# EAGLE design pcb paneles (EAGLE 9.6.1)
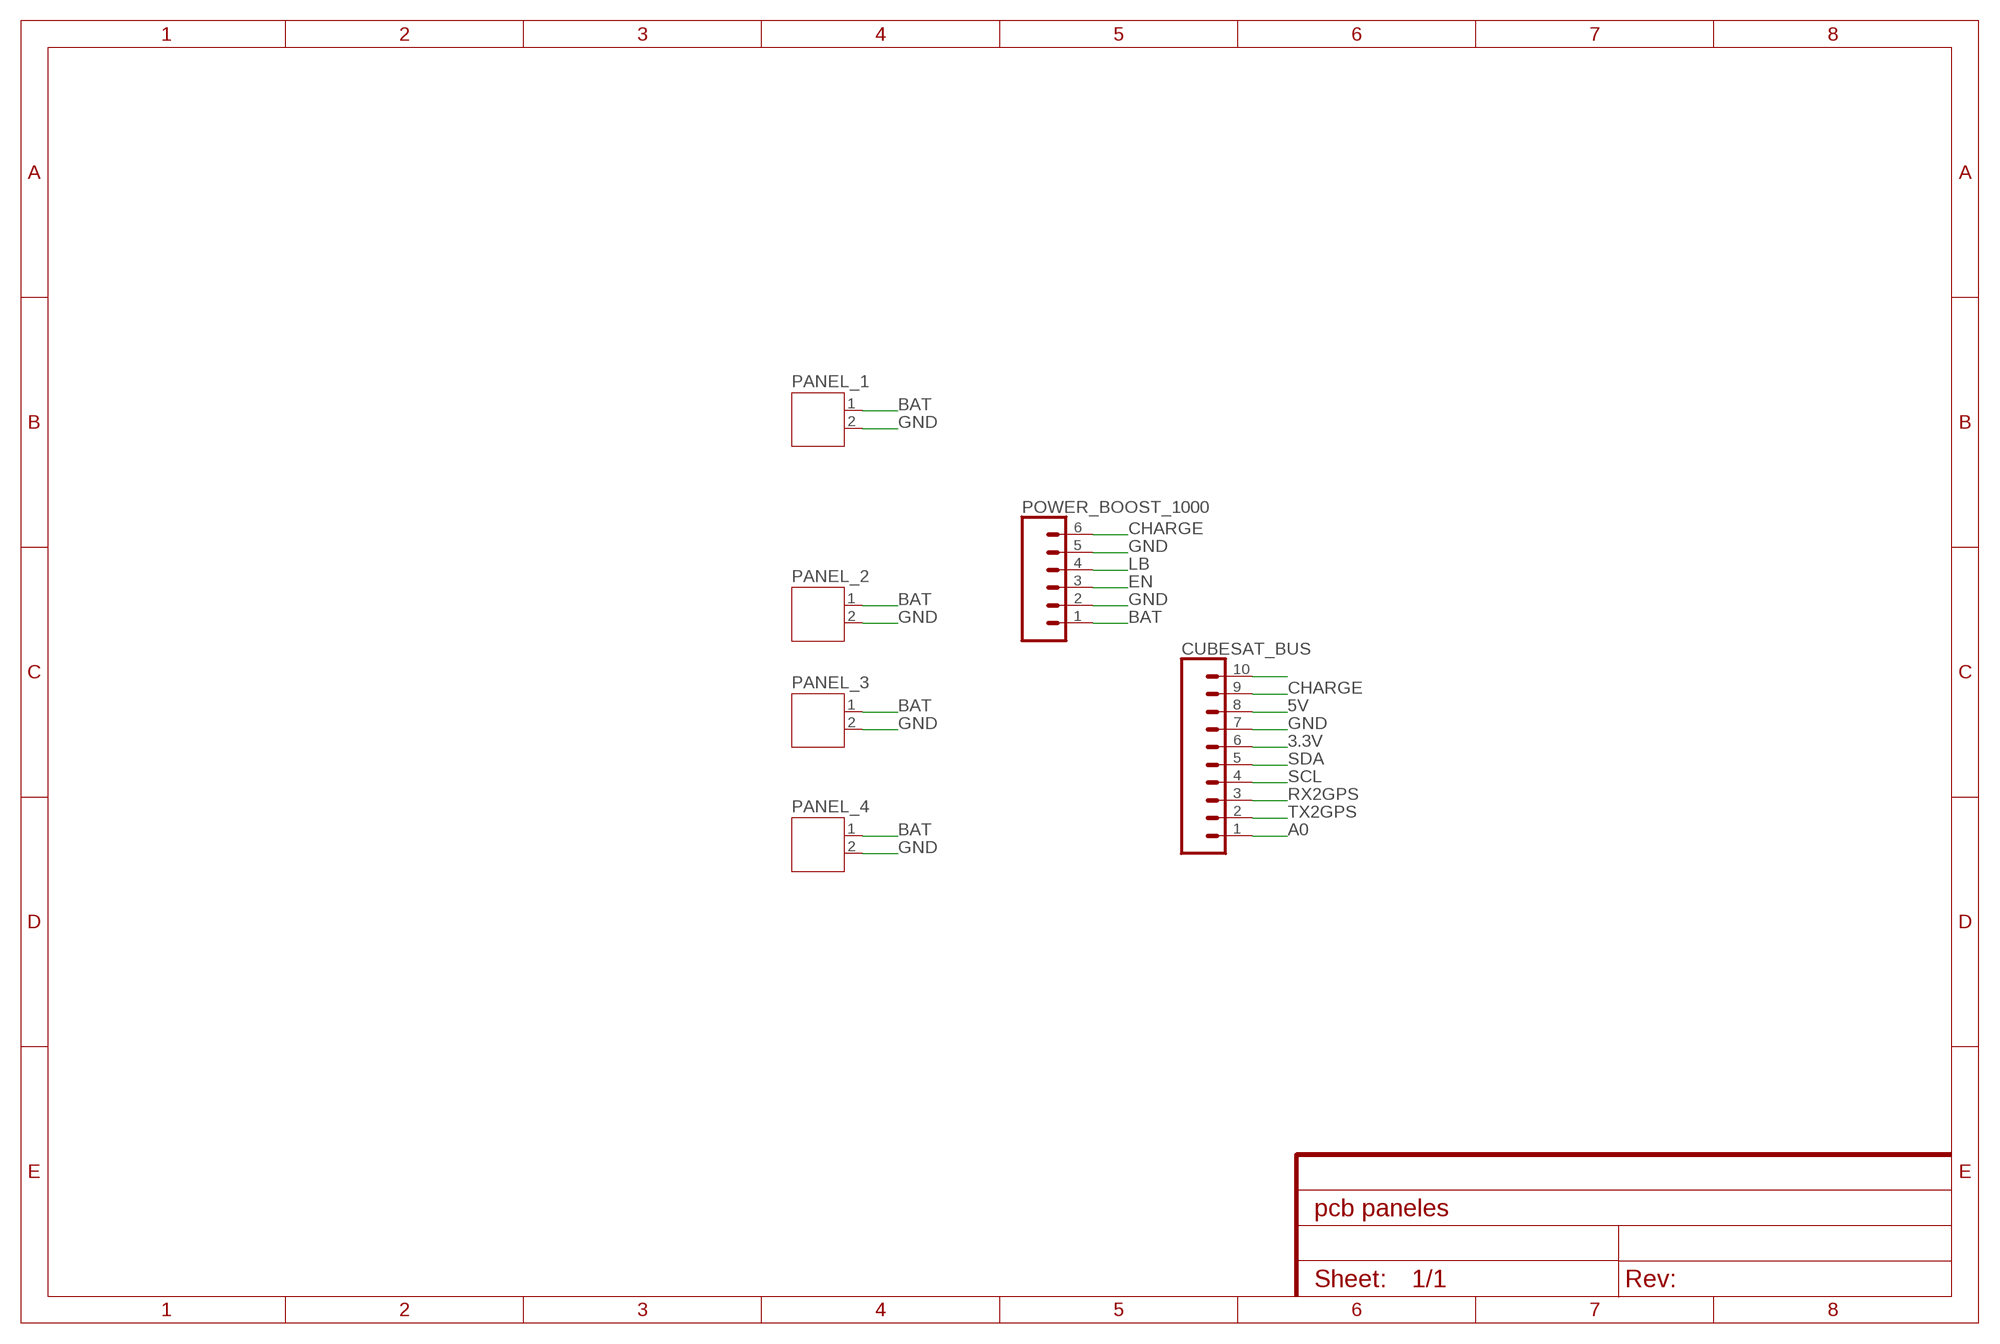
[diagram p0: schematic, sheet 1]

## Parts
CUBESAT_BUS  CONN_10"  [1X10]
PANEL_1  JST-PH2  [JST-PH2]
PANEL_2  JST-PH2  [JST-PH2]
PANEL_3  JST-PH2  [JST-PH2]
PANEL_4  JST-PH2  [JST-PH2]
POWER_BOOST_1000  CONN_06SILK_FEMALE_PTH  [1X06]

## Nets
3.3V: CUBESAT_BUS.6
5V: CUBESAT_BUS.8
A0: CUBESAT_BUS.1
BAT: PANEL_1.1 PANEL_2.1 PANEL_3.1 PANEL_4.1 POWER_BOOST_1000.1
CHARGE: CUBESAT_BUS.9 POWER_BOOST_1000.6
EN: POWER_BOOST_1000.3
GND: CUBESAT_BUS.7 PANEL_1.2 PANEL_2.2 PANEL_3.2 PANEL_4.2 POWER_BOOST_1000.2 POWER_BOOST_1000.5
LB: POWER_BOOST_1000.4
N$9: CUBESAT_BUS.10
RX2GPS: CUBESAT_BUS.3
SCL: CUBESAT_BUS.4
SDA: CUBESAT_BUS.5
TX2GPS: CUBESAT_BUS.2

## Library data of the parts
CUBESAT_BUS = SparkFun-Connectors:CONN_10: Multi connection point. Often used as Generic Header-pin footprint for 0.1 inch spaced/style header connections On any of the 0.1 inch spaced packages, you can populate with these: Break Away Headers - Straight <https://www.sparkfun.com/products/116> (PRT-00116) Break Away Male Headers - Right Angle <https://www.sparkfun.com/products/553> (PRT-00553) Female Headers <https://www.sparkfun.com/products/115> (PRT-00115) Break Away Headers - Machine Pin <https://www.sparkfun.com/products/117> (PRT-00117) Break Away Female Headers - Swiss Machine Pin <https://www.sparkfun.com/products/743> (PRT-00743) Arduino Stackable Header - 10 Pin <https://www.sparkfun.com/products/11376> (PRT-11376) For SCREWTERMINALS and SPRING TERMINALS visit here: Screw Terimnals on SparkFun.com <https://www.sparkfun.com/search/results?term=Screw+Terminals> (5mm/3.5mm/2.54mm spacing) This device is also useful as a general connection point to wire up your design to another part of your project. Our various solder wires solder well into these plated through hole pads. Hook-Up Wire - Assortment (Stranded, 22 AWG) <https://www.sparkfun.com/products/11375> (PRT-11375) Hook-Up Wire - Assortment (Solid Core, 22 AWG) <https://www.sparkfun.com/products/11367> (PRT-11367) View the entire wire category on our website here <https://www.sparkfun.com/categories/141> Special notes: Molex polarized connector foot print use with SKU : PRT-08231 with associated crimp pins and housings. 1MM SMD Version SKU: PRT-10208 NOTES ON THE VARIANTS LOCK and LOCK_LONGPADS... This footprint was designed to help hold the alignment of a through-hole component (i.e. 6-pin header) while soldering it into place. You may notice that each hole has been shifted either up or down by 0.005 of an inch from it's more standard position (which is a perfectly straight line). This slight alteration caused the pins (the squares in the middle) to touch the edges of the holes. Because they are alternating, it causes a "brace" to hold the component in place. 0.005 has proven to be the perfect amount of "off-center" position when using our standard breakaway headers. Although looks a little odd when you look at the bare footprint, once you have a header in there, the alteration is very hard to notice. Also,if you push a header all the way into place, it is covered up entirely on the bottom side.; PROD_ID: CONN-11563
PANEL_1-PANEL_4 = jst-ph:JST-PH2
POWER_BOOST_1000 = SparkFun-Connectors:CONN_06: Multi connection point. Often used as Generic Header-pin footprint for 0.1 inch spaced/style header connections On any of the 0.1 inch spaced packages, you can populate with these: Break Away Headers - Straight <https://www.sparkfun.com/products/116> (PRT-00116) Break Away Male Headers - Right Angle <https://www.sparkfun.com/products/553> (PRT-00553) Female Headers <https://www.sparkfun.com/products/115> (PRT-00115) Break Away Headers - Machine Pin <https://www.sparkfun.com/products/117> (PRT-00117) Break Away Female Headers - Swiss Machine Pin <https://www.sparkfun.com/products/743> (PRT-00743) Arduino Stackable Header - 6 Pin <https://www.sparkfun.com/products/9280> (PRT-09280) For SCREWTERMINALS and SPRING TERMINALS visit here: Screw Terimnals on SparkFun.com <https://www.sparkfun.com/search/results?term=Screw+Terminals> (5mm/3.5mm/2.54mm spacing) This device is also useful as a general connection point to wire up your design to another part of your project. Our various solder wires solder well into these plated through hole pads. Hook-Up Wire - Assortment (Stranded, 22 AWG) <https://www.sparkfun.com/products/11375> (PRT-11375) Hook-Up Wire - Assortment (Solid Core, 22 AWG) <https://www.sparkfun.com/products/11367> (PRT-11367) View the entire wire category on our website here <https://www.sparkfun.com/categories/141>; PROD_ID: CONN-08437

## Board
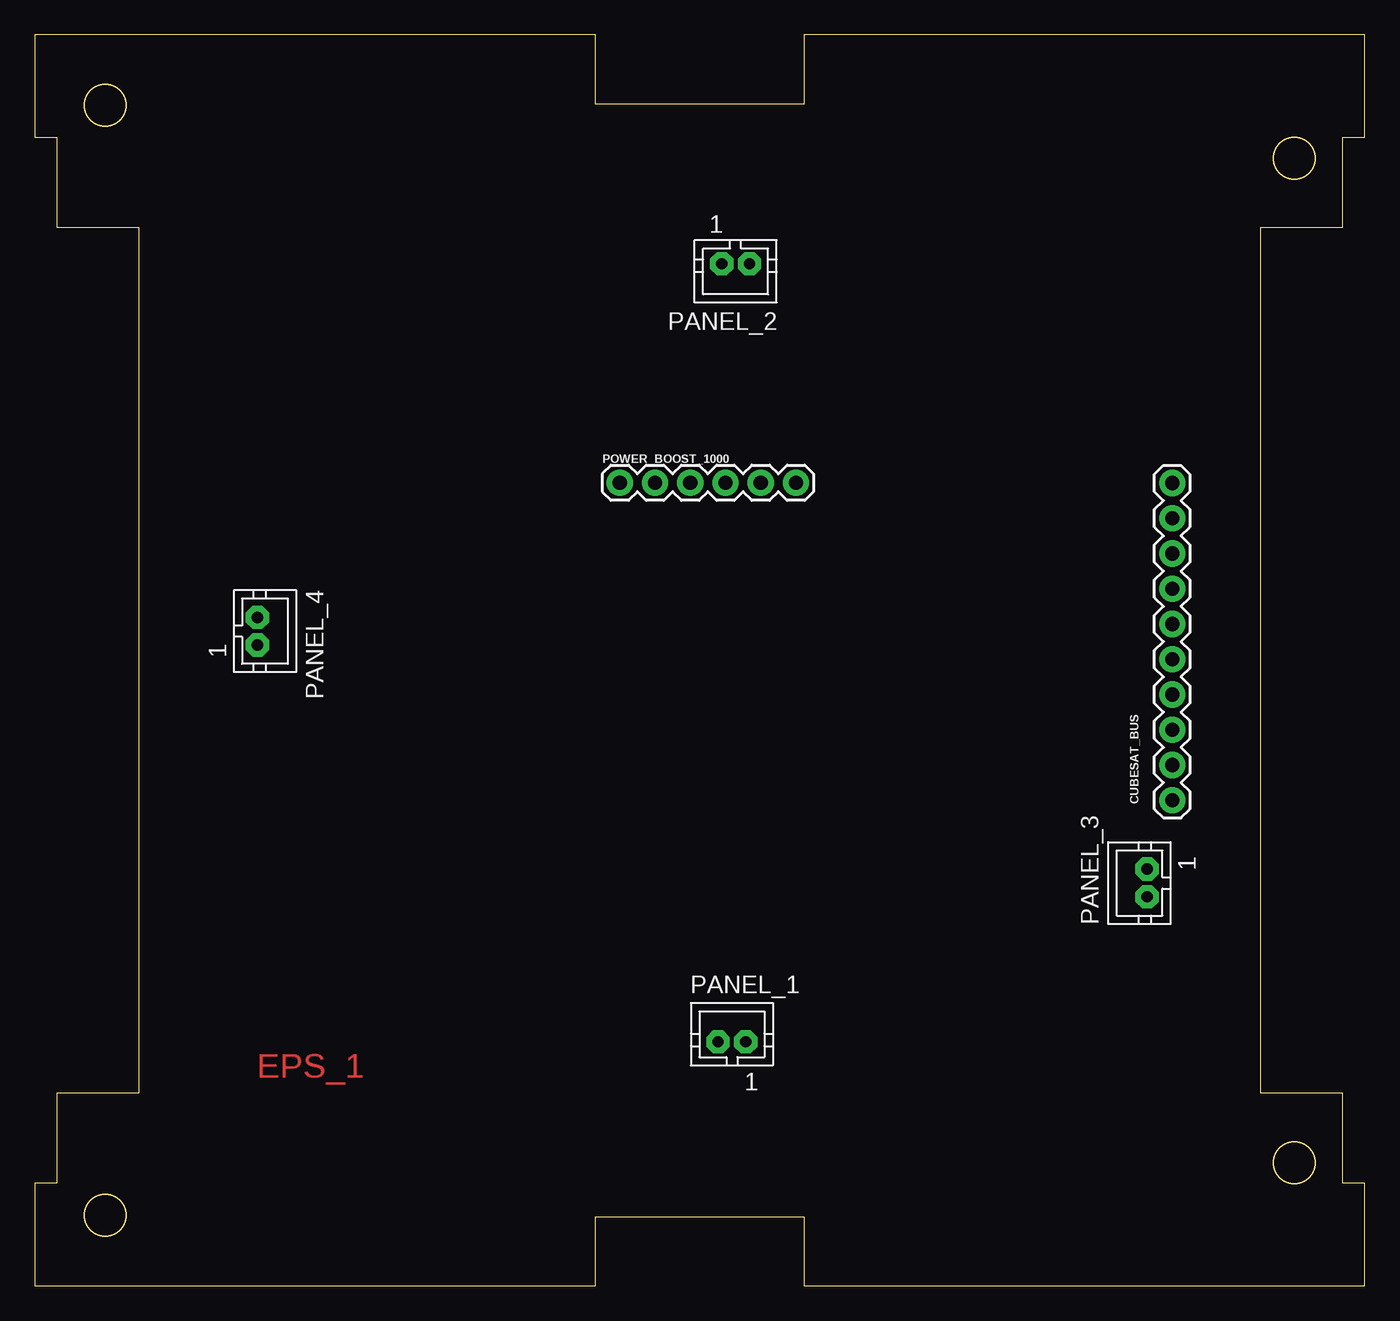
[diagram p1: board, top side]
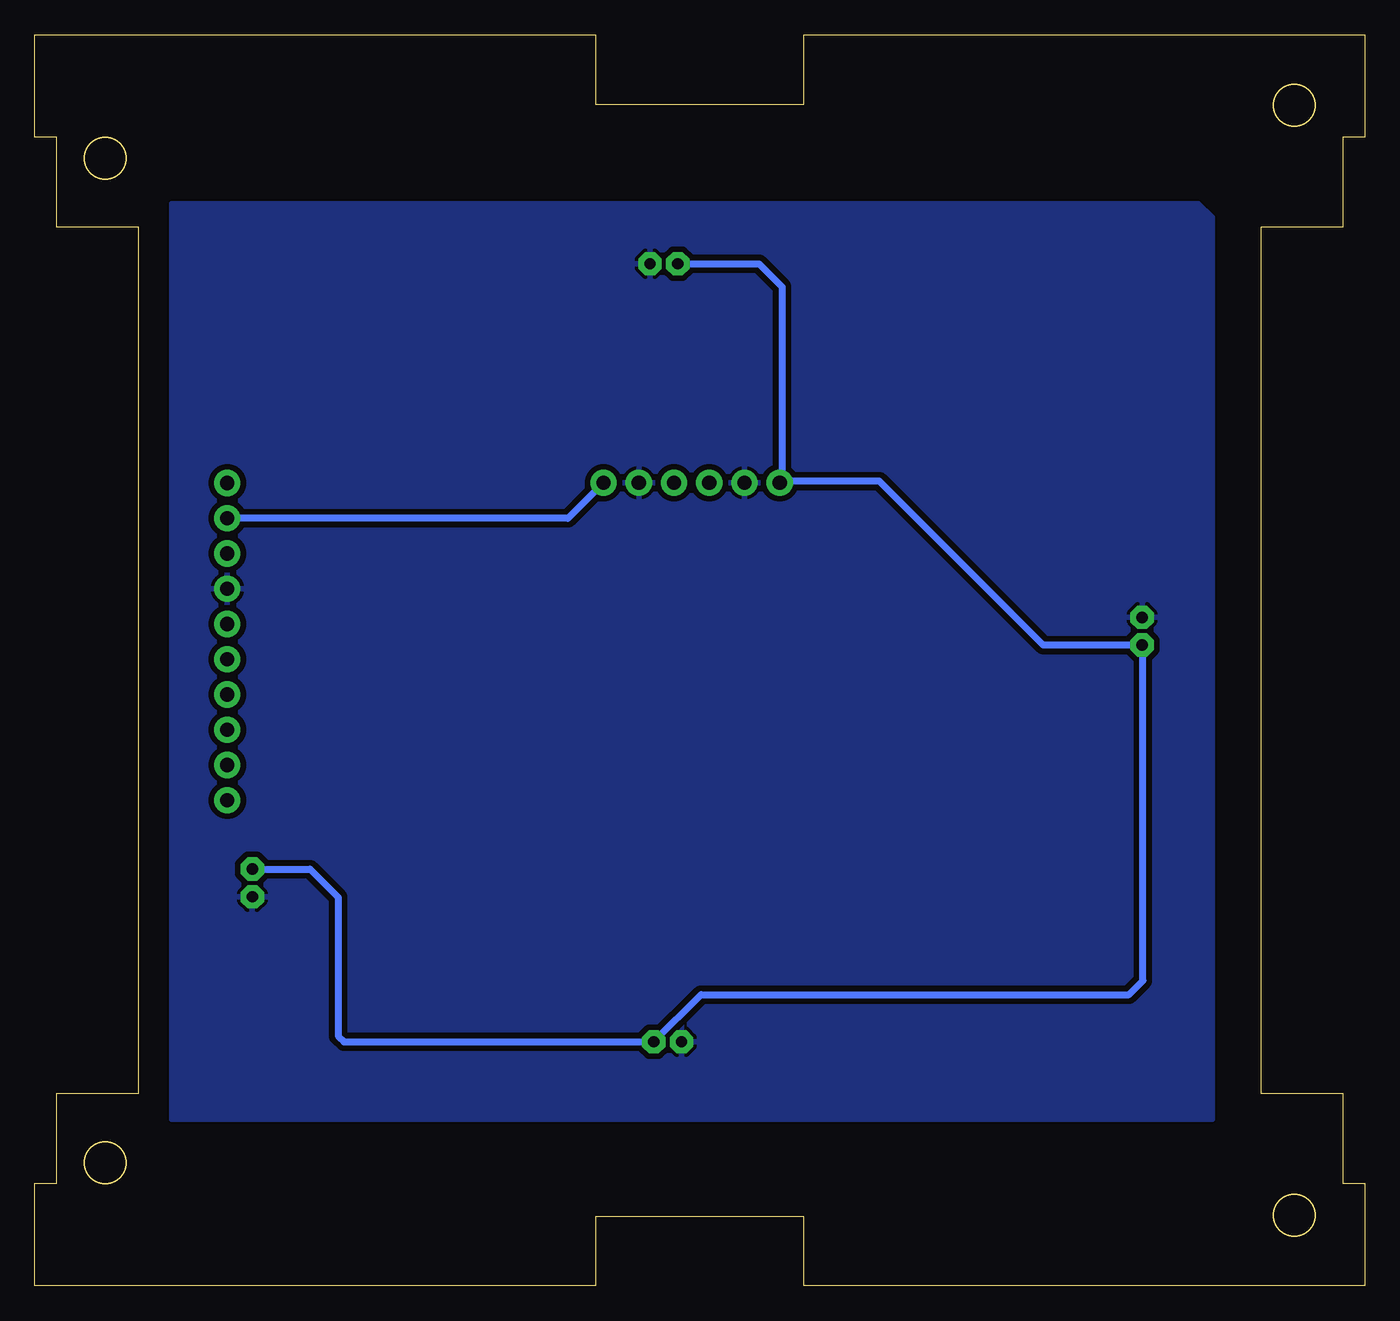
[diagram p2: board, bottom side, seen from below]

Size 95.89 x 90.17 mm. Coordinates in mm from the lower left corner, seen from the top.
Outline: 0,0 40.45,0 40.45,5 55.45,5 55.45,0 95.89,0 95.89,7.4 94.29,7.4 94.29,13.89 88.39,13.89 88.39,76.28 94.29,76.28 94.29,82.77 95.89,82.77 95.89,90.17 55.45,90.17 55.45,85.17 40.45,85.17 40.45,90.17 0,90.17 0,82.77 1.6,82.77 1.6,76.28 7.5,76.28 7.5,13.89 1.6,13.89 1.6,7.4 0,7.4 0,0
Outline: circle at 5.08,5.08 radius 1.5
Outline: circle at 90.81,81.28 radius 1.5
Outline: circle at 5.08,85.09 radius 1.5
Outline: circle at 90.81,8.89 radius 1.5
Copper layers (1*16): Top 0.035mm / dielectric 1.5mm / Bottom 0.035mm
Design rules "default": minimum track width 6mil, minimum drill 0.35mm, track to track 6mil, track to pad 6mil, pad to pad 6mil, via to via 6mil, smd to smd 6mil, copper to edge 40mil, drill to drill 6mil, minimum pad ring 10mil, minimum via ring 8mil, stop-mask expansion 4mil, vias tented up to drill 0mil, thermal gap 10mil

### Footprints (pad centres in the part's own frame; a part is rotated, then mirrored left to right if it is on the bottom)
1X10 = drill 1.016 pad 1.88: 1 0,0; 2 2.54,0; 3 5.08,0; 4 7.62,0; 5 10.16,0; 6 12.7,0; 7 15.24,0; 8 17.78,0; 9 20.32,0; 10 22.86,0
JST-PH2 = drill 0.813 pad 1.676 octagon: 1 1,0; 2 -1,0
1X06 = drill 1.016 pad 1.88: 1 0,0; 2 2.54,0; 3 5.08,0; 4 7.62,0; 5 10.16,0; 6 12.7,0

### Placement (x,y rotation side)
CUBESAT_BUS  82,35 90 top
PANEL_1  50.26,17.59 0 top
PANEL_2  50.53,73.66 180 top
PANEL_3  80.2,29.04 90 top
PANEL_4  16.05,47.18 270 top
POWER_BOOST_1000  42.18,57.88 0 top

### Tracks (layer width: path | path; a pad name or v marks a point on that pad's centre or on a via)
BAT
  Bottom 0.305: 42.18,58 POWER_BOOST_1000.1
  Bottom 0.508: 42,58 35,58 23.18,46.18 PANEL_4.1 16,46.13 16,22 17,21 47.85,21 PANEL_1.1 73.59,17.59 74,18 74,28 76.04,30.04 PANEL_3.1 | 42,58 42.18,58 | PANEL_2.1 43.66,73.66 42,72 42,58
CHARGE
  Bottom 0.508: POWER_BOOST_1000.6 57.44,55.32 CUBESAT_BUS.9
GND
  pour Bottom (isolate 0.406): 11,77 11,12 86,12 86,78 12,78

### Text on the board
Top: EPS_1